# EAGLE design USBasp_smd04 (EAGLE 4.16)
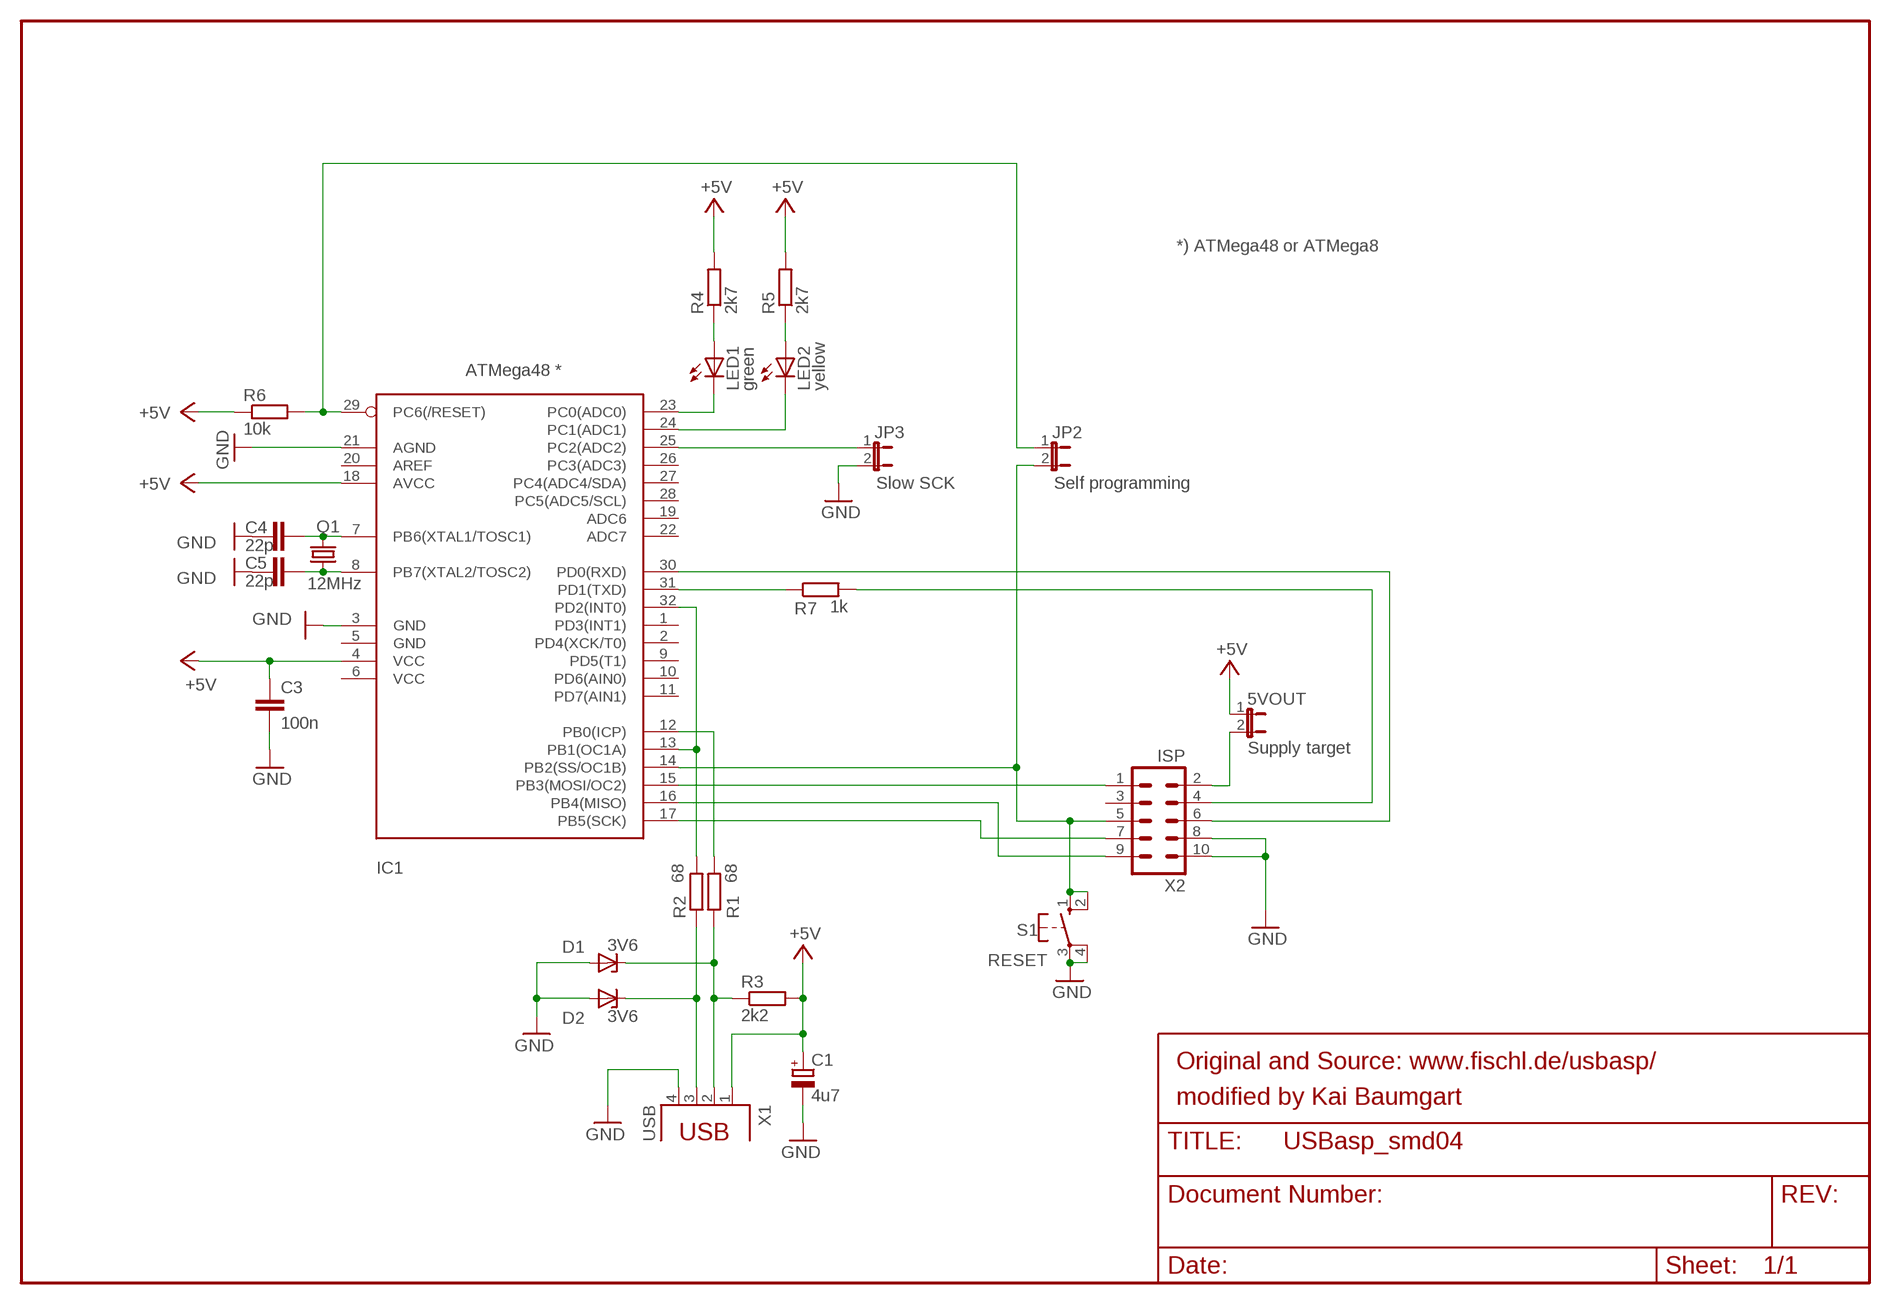
[diagram p0: schematic, sheet 1]

## Parts
5VOUT  Supply target  JP1E  [JP1]
C1  4u7  CPOL-EUE2.5-5  [E2,5-5]
C3  100n  C-EUC0603  [C0603]
C4  22p  C-EUC0603  [C0603]
C5  22p  C-EUC0603  [C0603]
D1  3V6  ZENER-DIODESOT23  [SOT23]
D2  3V6  ZENER-DIODESOT23  [SOT23]
IC1  ATMega48 *  MEGA8-AI  [TQFP32-08]
JP2  Self programming  JP1E  [JP1]
JP3  Slow SCK  JP1E  [JP1]
LED1  green  LEDCHIPLED_0603  [CHIPLED_0603]
LED2  yellow  LEDCHIPLED_0603  [CHIPLED_0603]
Q1  12MHz  CRYTALHC49S  [HC49/S]
R1  68  R-EU_R0805  [R0805]
R2  68  R-EU_R0805  [R0805]
R3  2k2  R-EU_R0805  [R0805]
R4  2k7  R-EU_R0805  [R0805]
R5  2k7  R-EU_R0805  [R0805]
R6  10k  R-EU_R0805  [R0805]
R7  1k  R-EU_R0805  [R0805]
S1  RESET  10-XX  [B3F-10XX]
X1  USB  PN61729  [PN61729]
X2  ISP  ML10L  [ML10L]

## Nets
+5V: 5VOUT.1 C1.+ C3.1 IC1.4(VCC) IC1.18(AVCC) R3.2 R4.2 R5.2 R6.1 X1.1
GND: C1.- C3.2 C4.1 C5.2 D1.1(A) D2.1(A) IC1.3(GND) IC1.21(AGND) JP3.2 S1.3(P) S1.4(P1) X1.4 X2.8 X2.10
N$1: IC1.29(PC6(/RESET)) JP2.1 R6.2
N$2: IC1.14(PB2(SS/OC1B)) JP2.2 S1.1(S) S1.2(S1) X2.5
N$3: IC1.15(PB3(MOSI/OC2)) X2.1
N$4: IC1.17(PB5(SCK)) X2.7
N$5: D1.3(C) R1.1 R3.1 X1.2
N$6: IC1.16(PB4(MISO)) X2.9
N$7: IC1.13(PB1(OC1A)) IC1.32(PD2(INT0)) R2.2
N$8: D2.3(C) R2.1 X1.3
N$9: IC1.31(PD1(TXD)) R7.1
N$10: R7.2 X2.4
N$11: IC1.30(PD0(RXD)) X2.6
N$12: IC1.25(PC2(ADC2)) JP3.1
N$13: LED1.A R4.1
N$14: IC1.23(PC0(ADC0)) LED1.C
N$15: IC1.24(PC1(ADC1)) LED2.C
N$16: LED2.A R5.1
N$17: 5VOUT.2 X2.2
N$20: IC1.12(PB0(ICP)) R1.2
N$22: C4.2 IC1.7(PB6(XTAL1/TOSC1)) Q1.2
N$23: C5.1 IC1.8(PB7(XTAL2/TOSC2)) Q1.1
Unconnected: IC1.1(PD3(INT1)) IC1.2(PD4(XCK/T0)) IC1.5(GND) IC1.6(VCC) IC1.9(PD5(T1)) IC1.10(PD6(AIN0)) IC1.11(PD7(AIN1)) IC1.19(ADC6) IC1.20(AREF) IC1.22(ADC7) IC1.26(PC3(ADC3)) IC1.27(PC4(ADC4/SDA)) IC1.28(PC5(ADC5/SCL)) X2.3

## Notes on the sheet
- *) ATMega48 or ATMega8
- Original and Source: www.fischl.de/usbasp/
- modified by Kai Baumgart

## Library data of the parts
5VOUT JP2 JP3 = jumper:JP1E: JUMPER
C1 = rcl:CPOL-EU: POLARIZED CAPACITOR, European symbol
C3-C5 = rcl:C-EU: CAPACITOR, European symbol
D1 D2 = diode:ZENER-DIODE: Z-Diode
IC1 = atmel:MEGA8: MICROCONTROLLER 8 Kbytes FLASH 1 kbytes SRAM 512 bytes EEPROM USART 6-channel 10 bit ADC 2-channel 8 bit ADC Source: avr.lbr
LED1 LED2 = led:LED: LED OSRAM: - CHIPLED LG R971, LG N971, LY N971, LG Q971, LY Q971, LO R971, LY R971 LH N974, LH R974 LS Q976, LO Q976, LY Q976 LO Q996 - Hyper CHIPLED LW Q18S LB Q993, LB Q99A, LB R99A - SideLED LS A670, LO A670, LY A670, LG A670, LP A670 LB A673, LV A673, LT A673, LW A673 LH A674 LY A675 LS A676, LA A676, LO A676, LY A676, LW A676 LS A679, LY A679, LG A679 - Hyper Micro SIDELED® LS Y876, LA Y876, LO Y876, LY Y876 LT Y87S - SmartLED LW L88C, LW L88S LB L89C, LB L89S, LG L890 LS L89K, LO L89K, LY L89K LS L896, LA L896, LO L896, LY L896 - TOPLED LS T670, LO T670, LY T670, LG T670, LP T670 LSG T670, LSP T670, LSY T670, LOP T670, LYG T670 LG T671, LOG T671, LSG T671 LB T673, LV T673, LT T673, LW T673 LH T674 LS T676, LA T676, LO T676, LY T676, LB T676, LH T676, LSB T676, LW T676 LB T67C, LV T67C, LT T67C, LS T67K, LO T67K, LY T67K, LW E67C LS E67B, LA E67B, LO E67B, LY E67B, LB E67C, LV E67C, LT E67C LW T67C LS T679, LY T679, LG T679 LS T770, LO T770, LY T770, LG T770, LP T770 LB T773, LV T773, LT T773, LW T773 LH T774 LS E675, LA E675, LY E675, LS T675 LS T776, LA T776, LO T776, LY T776, LB T776 LHGB T686 LT T68C, LB T68C - Hyper Mini TOPLED® LB M676 - Mini TOPLED Santana® LG M470 LS M47K, LO M47K, LY M47K Source: http://www.osram.convergy.de/
Q1 = crystal:CRYTAL: CRYSTAL
R1-R7 = rcl:R-EU_: RESISTOR, European symbol
S1 = switch-omron:10-XX: OMRON SWITCH
X1 = con-berg:PN61729: BERG USB connector
X2 = con-harting-ml:ML10: HARTING

## Board
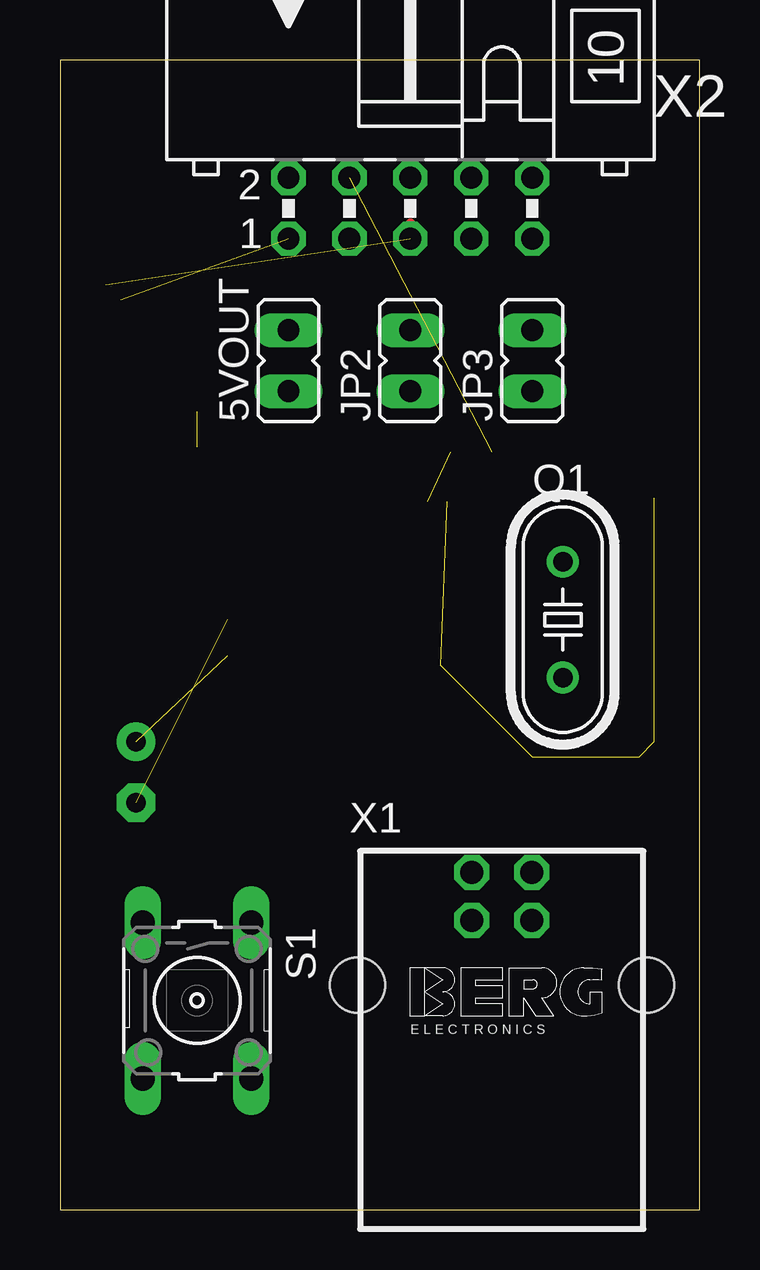
[diagram p1: board, top side]
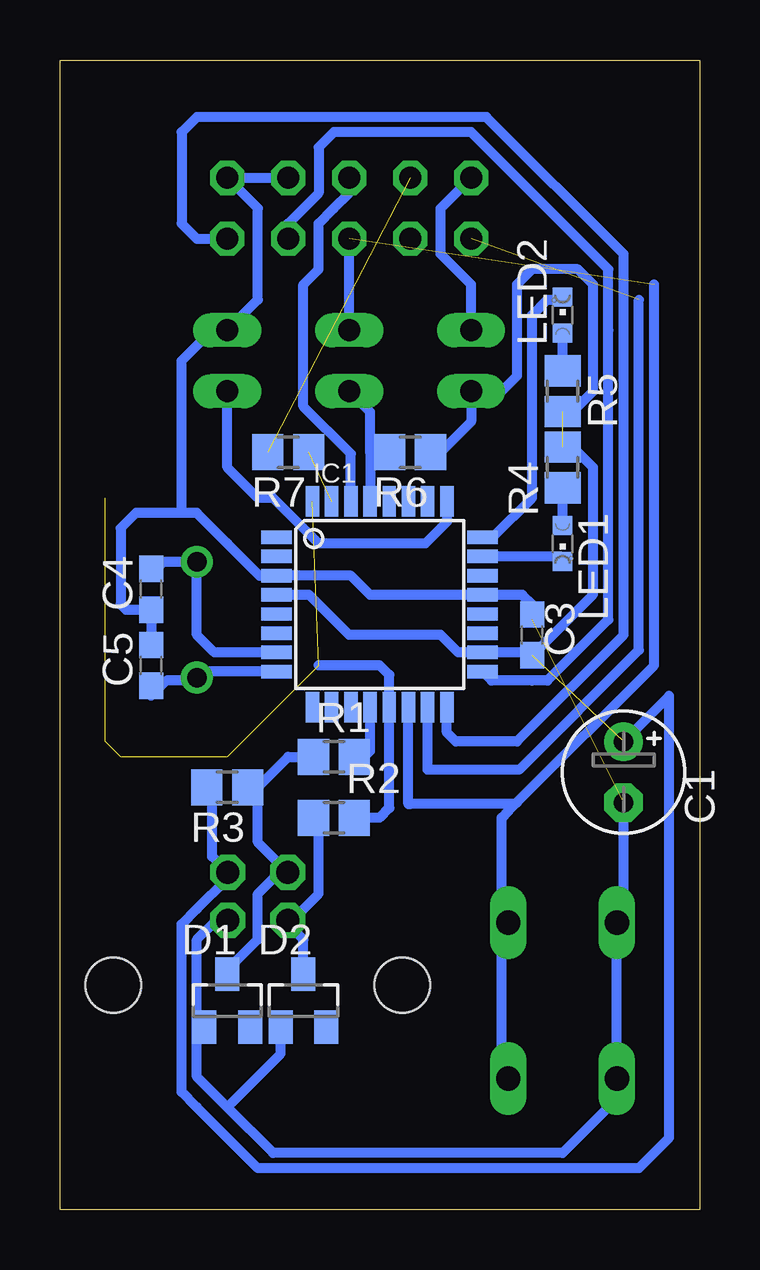
[diagram p2: board, bottom side, seen from below]

Size 26.65 x 47.93 mm. Coordinates in mm from the lower left corner, seen from the top.
Outline: 0,0 26.65,0 26.65,47.93 0,47.93 0,0
Copper layers (1*16): Top 0.035mm / dielectric 1.5mm / Bottom 0.035mm
Design rules "olimex_8mils": minimum track width 10mil, minimum drill 24mil, track to track 8mil, track to pad 8mil, pad to pad 8mil, via to via 8mil, smd to smd 8mil, copper to edge 40mil, drill to drill 10mil, minimum pad ring 10mil, minimum via ring 8mil, stop-mask expansion 0mil, vias tented up to drill 0mil, thermal gap 10mil

### Footprints (pad centres in the part's own frame; a part is rotated, then mirrored left to right if it is on the bottom)
JP1 = drill 0.914 long: 1 0,-1.27; 2 0,1.27
E2,5-5 = drill 0.813 pad 1.6 round: + -1.27,0 | drill 0.813 pad 1.6 octagon: - 1.27,0
C0603 = smd 1.1 x 1: 1 -0.85,0; 2 0.85,0
SOT23 = smd 1 x 1.4: 1 -0.95,-1.1; 2 0.95,-1.1; 3 0,1.1
TQFP32-08 = smd 1.27 x 0.559: 1 -4.293,2.8; 2 -4.293,2; 3 -4.293,1.2; 4 -4.293,0.4; 5 -4.293,-0.4; 6 -4.293,-1.2; 7 -4.293,-2; 8 -4.293,-2.8; 17 4.293,-2.8; 18 4.293,-2; 19 4.293,-1.2; 20 4.293,-0.4; 21 4.293,0.4; 22 4.293,1.2; 23 4.293,2; 24 4.293,2.8 | smd 0.559 x 1.27: 9 -2.8,-4.293; 10 -2,-4.293; 11 -1.2,-4.293; 12 -0.4,-4.293; 13 0.4,-4.293; 14 1.2,-4.293; 15 2,-4.293; 16 2.8,-4.293; 25 2.8,4.293; 26 2,4.293; 27 1.2,4.293; 28 0.4,4.293; 29 -0.4,4.293; 30 -1.2,4.293; 31 -2,4.293; 32 -2.8,4.293
CHIPLED_0603 = smd 0.8 x 0.8: A 0,-0.75; C 0,0.75
HC49/S = drill 0.813 round: 1 -2.413,0; 2 2.413,0
R0805 = smd 1.3 x 1.5: 1 -0.85,0; 2 0.85,0
B3F-10XX = drill 1.016 long: 1 -3.251,2.261; 2 3.251,2.261; 3 -3.251,-2.261; 4 3.251,-2.261
PN61729 = drill 0.95 octagon: 1 1.25,4.71; 2 -1.25,4.71; 3 -1.25,2.71; 4 1.25,2.71 | hole 2.3: -6.02,0; 6.02,0
ML10L = drill 0.914 octagon: 1 -5.08,-1.27; 2 -5.08,1.27; 3 -2.54,-1.27; 4 -2.54,1.27; 5 0,-1.27; 6 0,1.27; 7 2.54,-1.27; 8 2.54,1.27; 9 5.08,-1.27; 10 5.08,1.27

### Placement (x,y rotation side)
5VOUT  9.52,35.39 0 top
C1  3.17,18.25 270 bottom
C3  6.98,23.96 90 bottom
C4  22.86,25.87 90 bottom
C5  22.86,22.7 90 bottom
D1  19.68,8.73 0 bottom
D2  16.5,8.73 0 bottom
IC1  13.33,25.23 0 bottom
JP2  14.6,35.39 0 top
JP3  19.68,35.39 0 top
LED1  5.71,27.77 180 bottom
LED2  5.71,37.3 0 bottom
Q1  20.95,24.6 90 top
R1  15.24,18.88 0 bottom
R2  15.24,16.34 0 bottom
R3  19.68,17.61 180 bottom
R4  5.71,30.95 90 bottom
R5  5.71,34.12 270 bottom
R6  12.06,31.58 180 bottom
R7  17.14,31.58 180 bottom
S1  5.71,8.73 270 top
X1  18.41,9.36 0 top
X2  14.6,41.74 0 top

### Tracks (layer width: path | path; a pad name or v marks a point on that pad's centre or on a via)
+5V  (2 unrouted)
  Bottom 0.406: IC1.4 16.27,25.63 14.6,23.96 13.33,23.96 10.79,23.96 10.16,23.33 10.06,23.23 IC1.18 7.08,23.23 6.98,23.33 C3.1 4.44,25.65 4.44,29.04 4.44,29.68 4.44,30.95 5.08,31.58 5.71,31.58 R4.2 | R3.2 20.31,17.61 20.31,14.73 X1.1 19.66,13.83 19.68,13.81 20.95,12.54 21.58,11.9 21.58,4.92 20.95,4.28 18.41,1.74 2.54,1.74 1.27,3.01 1.27,21.42 C1.+ | R5.2 5.29,33.27 4.44,34.12 4.44,37.3 4.44,38.57 5.08,39.2 6.98,39.2 7.62,38.57 7.62,34.76 8.25,34.12 5VOUT.1 9.52,32.85 10.79,31.58 R6.1
GND  (1 unrouted)
  Bottom 0.406: C3.2 6.98,24.6 6.98,25.23 7.38,25.63 IC1.21 10.79,25.63 13.73,25.63 13.97,25.87 14.53,26.43 IC1.3 18.34,26.43 19.68,27.77 20.95,29.04 21.58,29.04 | 19.68,11.9 19.66,11.92 X1.4 20.14,12.07 20.95,11.27 20.95,7.46 | 19.68,4.28 17.77,2.38 5.71,2.38 3.17,4.92 3.17,5.55 3.37,5.55 S1.4 3.45,11.54 3.8,11.9 3.73,11.98 S1.3 3.17,12.26 C1.- | 19.68,4.28 20.95,5.55 20.95,7.46 | D1.1 20.78,7.62 20.95,7.46 | D2.1 17.45,6.5 19.68,4.28 | C4.1 22.86,25.23 C4.1 | C4.1 C5.2 | C4.1 23.91,25.02 24.12,25.23 24.12,28.41 23.49,29.04 21.58,29.04 | X2.8 X2.10 18.41,41.74 18.41,37.94 JP3.2 19.04,36.66 20.31,36.66 21.58,35.39 21.58,29.04
N$1
  Bottom 0.406: 13.73,31.58 IC1.29 | 13.73,31.58 13.73,33.25 JP2.1 | 13.73,31.58 13.33,31.58 R6.2
N$2  (1 unrouted)
  Top 0.406: X2.5 14.6,41.11
  Bottom 0.406: IC1.14 12.13,16.91 12.06,16.91 | 12.06,16.91 7.68,16.91 7.62,16.98 | 7.62,16.98 1.9,22.7 1.9,38.57 | 12.06,16.91 12.06,16.98 | 7.62,16.98 7.97,16.62 8.25,16.34 8.25,11.9 | 8.25,11.9 8.05,11.9 | 8.05,11.9 S1.1 8.05,11.9 | S1.2 8.25,5.75 8.25,11.9 | 8.25,11.9 8.05,11.9 | JP2.2 X2.5
N$3  (1 unrouted)
  Bottom 0.406: IC1.15 11.33,18.34 7.52,18.34 2.54,23.33 2.54,37.94
N$4
  Bottom 0.406: IC1.17 8.66,22.06 6.98,22.06 6.34,22.06 3.8,24.6 3.8,36.66 3.8,39.2 8.89,44.28 9.52,44.92 15.24,44.92 15.87,44.28 15.87,42.38 17.14,41.11 X2.7
N$5
  Bottom 0.406: R1.1 15.87,18.88 16.5,18.88 17.14,18.88 18.41,17.61 | 18.41,17.61 R3.1 18.41,17.61 | 18.41,17.61 18.41,15.32 X1.2 17.51,14.07 18.41,13.17 18.41,11.27 19.68,10 D1.3
N$6
  Bottom 0.406: IC1.16 10.53,19.89 10.16,19.52 7.62,19.52 3.17,23.96 3.17,37.3 3.17,39.84 8.89,45.55 20.31,45.55 20.95,45.55 21.58,44.92 21.58,41.11 20.95,40.48 X2.9
N$7  (5 unrouted)
  Bottom 0.406: R2.2 14.6,16.34 13.33,16.34 12.93,16.74 IC1.13 12.93,22.29 13.33,22.7 15.87,22.7 | IC1.32 16.13,29.94
N$8
  Bottom 0.406: R2.1 16.5,16.34 15.87,15.71 15.87,13.17 16.97,12.07 X1.3 17.16,11.92 17.14,11.9 16.5,11.27 D2.3
N$9  (1 unrouted)
N$10  (1 unrouted)
N$11
  Bottom 0.406: IC1.30 14.53,31.52 16.5,33.49 16.5,38.57 15.87,39.2 15.87,41.11 15.24,41.74 14.6,42.38 X2.6
N$12
  Bottom 0.406: IC1.25 10.53,28.67 10.79,28.41 11.43,27.77 15.87,27.77 17.77,29.68 18.41,29.68 19.68,30.95 JP3.1
N$13
  Bottom 0.406: R4.1 5.71,29.68 LED1.A
N$14
  Bottom 0.406: LED1.C 5.71,27.14 5.8,27.23 IC1.23
N$15
  Bottom 0.406: IC1.24 8.62,28.04 6.98,29.68 6.98,37.3 6.34,37.94 5.71,37.94 LED2.C
N$16
  Bottom 0.406: LED2.A 5.71,36.66 R5.1
N$17
  Bottom 0.406: 5VOUT.2 9.52,38.57 10.79,39.84 10.79,41.74 X2.2
N$20
  Bottom 0.406: R1.2 13.97,18.88 13.73,19.12 IC1.12
N$22
  Bottom 0.406: IC1.7 20.22,23.23 20.95,23.96 Q1.2 | Q1.2 20.95,27.14 Q1.2 | C4.2 22.86,26.5 22.35,27.01 Q1.2
N$23
  Bottom 0.406: 20.95,22.06 Q1.1 | IC1.8 20.57,22.43 20.95,22.06 | C5.1 22.86,21.42 22.22,22.06 20.95,22.06